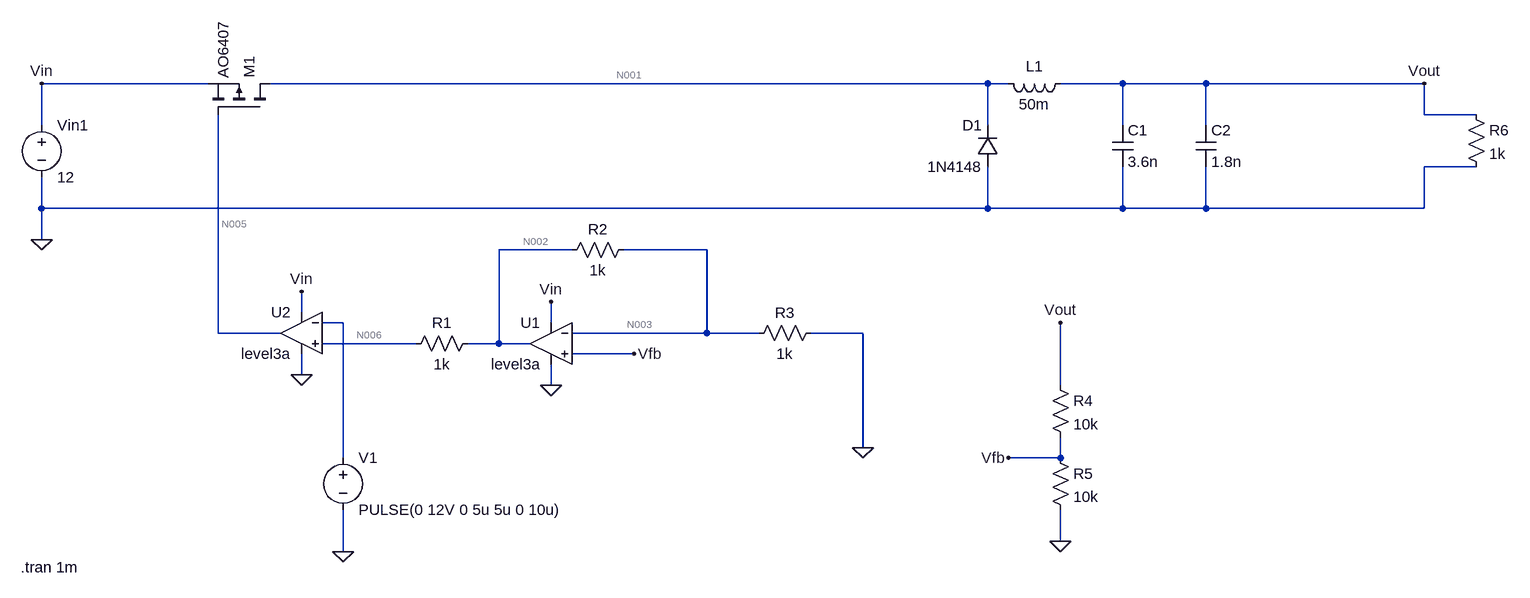
[diagram p0: schematic Buck_with_analog_feedback_improved.asc]
Buck_with_analog_feedback_improved.asc, the LTspice schematic file:
Version 4
SHEET 1 1724 1048
WIRE -960 0 -1216 0
WIRE 240 0 -864 0
WIRE 272 0 240 0
WIRE 448 0 352 0
WIRE 576 0 448 0
WIRE 912 0 576 0
WIRE 912 48 912 0
WIRE 992 48 912 48
WIRE -1216 64 -1216 0
WIRE 240 64 240 0
WIRE 448 64 448 0
WIRE 576 64 576 0
WIRE 992 128 912 128
WIRE -1216 192 -1216 144
WIRE 240 192 240 128
WIRE 240 192 -1216 192
WIRE 448 192 448 128
WIRE 448 192 240 192
WIRE 576 192 576 128
WIRE 576 192 448 192
WIRE 912 192 912 128
WIRE 912 192 576 192
WIRE -1216 240 -1216 192
WIRE -400 256 -512 256
WIRE -192 256 -320 256
WIRE -816 352 -816 320
WIRE -752 368 -784 368
WIRE -432 368 -432 336
WIRE -944 384 -944 48
WIRE -848 384 -944 384
WIRE -192 384 -192 256
WIRE -192 384 -400 384
WIRE -112 384 -192 384
WIRE 48 384 -32 384
WIRE -640 400 -784 400
WIRE -512 400 -512 256
WIRE -512 400 -560 400
WIRE -464 400 -512 400
WIRE -304 416 -400 416
WIRE -816 448 -816 416
WIRE -432 464 -432 432
WIRE 352 464 352 368
WIRE 48 560 48 384
WIRE -752 576 -752 368
WIRE 352 576 352 544
WIRE 352 576 272 576
WIRE 352 704 352 656
WIRE -752 720 -752 656
FLAG -1216 240 0
FLAG 912 0 Vout
FLAG -1216 0 Vin
FLAG -752 720 0
FLAG -816 448 0
FLAG -432 464 0
FLAG -816 320 Vin
FLAG -432 336 Vin
FLAG 48 560 0
FLAG 352 704 0
FLAG 272 576 Vfb
FLAG -304 416 Vfb
FLAG 352 368 Vout
SYMBOL voltage -1216 48 R0
WINDOW 123 0 0 Left 0
WINDOW 39 0 0 Left 0
SYMATTR InstName Vin1
SYMATTR Value 12
SYMBOL pmos -864 48 M270
SYMATTR InstName M1
SYMATTR Value AO6407
SYMBOL diode 256 128 R180
WINDOW 0 24 64 Left 2
WINDOW 3 24 0 Left 2
SYMATTR InstName D1
SYMATTR Value 1N4148
SYMBOL ind 368 -16 R90
WINDOW 0 5 56 VBottom 2
WINDOW 3 32 56 VTop 2
SYMATTR InstName L1
SYMATTR Value 50m
SYMBOL cap 432 64 R0
SYMATTR InstName C1
SYMATTR Value 3.6n
SYMBOL voltage -752 560 R0
WINDOW 123 0 0 Left 0
WINDOW 39 0 0 Left 0
SYMATTR InstName V1
SYMATTR Value PULSE(0 12V 0 5u 5u 0 10u)
SYMBOL res -544 384 R90
WINDOW 0 0 56 VBottom 2
WINDOW 3 32 56 VTop 2
SYMATTR InstName R1
SYMATTR Value 1k
SYMBOL OpAmps\\UniversalOpAmp3 -432 400 M0
SYMATTR InstName U1
SYMATTR Value2 Avol=100Meg GBW=10Meg Slew=10Meg
SYMATTR SpiceLine Ilimit=500m Rail=0 Vos=0 Phimargin=45
SYMATTR SpiceLine2 En=0 Enk=0 In=0 Ink=0 Rin=100G
SYMBOL OpAmps\\UniversalOpAmp3 -816 384 M0
SYMATTR InstName U2
SYMATTR Value2 Avol=100Meg GBW=10G Slew=10G
SYMATTR SpiceLine Ilimit=500m Rail=0 Vos=0 Phimargin=45
SYMATTR SpiceLine2 En=0 Enk=0 In=0 Ink=0 Rin=100G
SYMBOL res -304 240 R90
WINDOW 0 0 56 VBottom 2
WINDOW 3 32 56 VTop 2
SYMATTR InstName R2
SYMATTR Value 1k
SYMBOL res -16 368 R90
WINDOW 0 0 56 VBottom 2
WINDOW 3 32 56 VTop 2
SYMATTR InstName R3
SYMATTR Value 1k
SYMBOL res 336 448 R0
SYMATTR InstName R4
SYMATTR Value 10k
SYMBOL res 336 560 R0
SYMATTR InstName R5
SYMATTR Value 10k
SYMBOL cap 560 64 R0
SYMATTR InstName C2
SYMATTR Value 1.8n
SYMBOL res 976 32 R0
SYMATTR InstName R6
SYMATTR Value 1k
TEXT -1248 744 Left 2 !.tran 1m

The netlist it stands for:
* Buck_with_analog_feedback_improved.asc
Vin1 Vin 0 12
M1 N001 N005 Vin Vin AO6407
D1 0 N001 1N4148
L1 Vout N001 50m
C1 Vout 0 3.6n
V1 N004 0 PULSE(0 12V 0 5u 5u 0 10u)
R1 N002 N006 1k
XU1 Vfb N003 Vin 0 N002 level3a Avol=100Meg GBW=10Meg Slew=10Meg Ilimit=500m Rail=0 Vos=0 Phimargin=45 En=0 Enk=0 In=0 Ink=0 Rin=100G  ; pins In+ In- V+ V- OUT
XU2 N006 N004 Vin 0 N005 level3a Avol=100Meg GBW=10G Slew=10G Ilimit=500m Rail=0 Vos=0 Phimargin=45 En=0 Enk=0 In=0 Ink=0 Rin=100G  ; pins In+ In- V+ V- OUT
R2 N003 N002 1k
R3 0 N003 1k
R4 Vout Vfb 10k
R5 Vfb 0 10k
C2 Vout 0 1.8n
R6 Vout 0 1k
.model D D
.lib standard.dio
.model NMOS NMOS
.model PMOS PMOS
.lib standard.mos
.tran 1m
.backanno
.end

* Results of the author's LTspice run, read from the files saved beside the schematic
* Operating Point, zero values left out:
*   V(vin) = 12 V
*   V(n001) = 17.23 µV
*   V(n005) = 12 V
*   V(vout) = 17.23 µV
*   V(n002) = 2.592 mV
*   V(n006) = 2.592 mV
*   V(n003) = 1.296 mV
*   V(vfb) = 8.913 µV
*   Id(M1) = -18.05 nA
*   Is(M1) = 18.05 nA
*   I(L1) = -18.06 nA
*   I(R1) = -59.97 pA
*   I(R2) = -1.296 µA
*   I(R3) = -1.296 µA
*   I(R4) = 831.3 pA
*   I(R5) = 891.3 pA
*   I(R6) = 17.23 nA
*   I(Vin1) = -20.05 µA
*   I(V1) = 60 pA
*   Ix(u1:1) = -60 pA
*   Ix(u1:2) = -59.99 pA
*   Ix(u1:3) = 18.36 µA
*   Ix(u1:4) = -17 µA
*   Ix(u1:5) = -1.296 µA
*   Ix(u2:1) = -59.97 pA
*   Ix(u2:2) = -60 pA
*   Ix(u2:3) = 1.676 µA
*   Ix(u2:4) = -1.737 µA
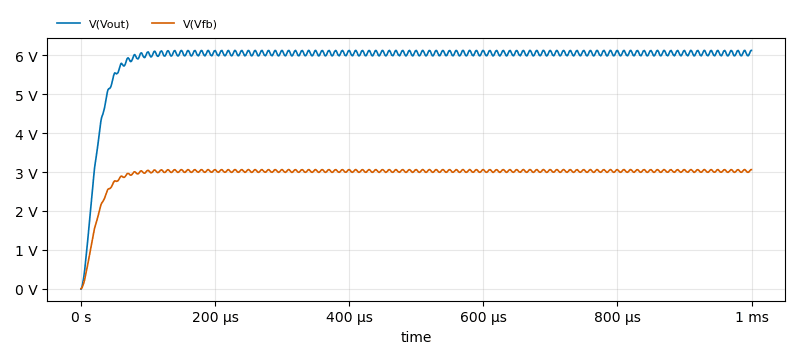
[diagram p1: Transient Analysis of Buck_with_analog_feedback_improved.asc, plotted from the saved traces]
* Transient Analysis, 1 run:
*   V(Vout): min 17.22 µV, max 6.125 V, average 5.903 V, rms 5.948 V, last 6.123 V
*   V(Vfb): min 8.911 µV, max 3.062 V, average 2.951 V, rms 2.974 V, last 3.062 V